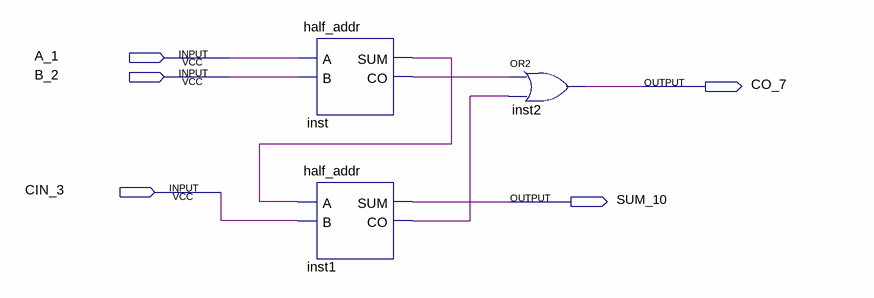
[diagram p0: schematic sheet]
// Quartus schematic full_addr.bdf as structural Verilog: 3 symbols, 5 pins
module full_addr (
  input  A_1,
  input  B_2,
  input  CIN_3,
  output CO_7,
  output SUM_10
);

  wire inst1_co, inst_co, inst_sum;

  half_addr inst (.A(A_1), .B(B_2), .SUM(inst_sum), .CO(inst_co));
  half_addr inst1 (.A(inst_sum), .B(CIN_3), .SUM(SUM_10), .CO(inst1_co));
  or inst2 (CO_7, inst_co, inst1_co);
endmodule
